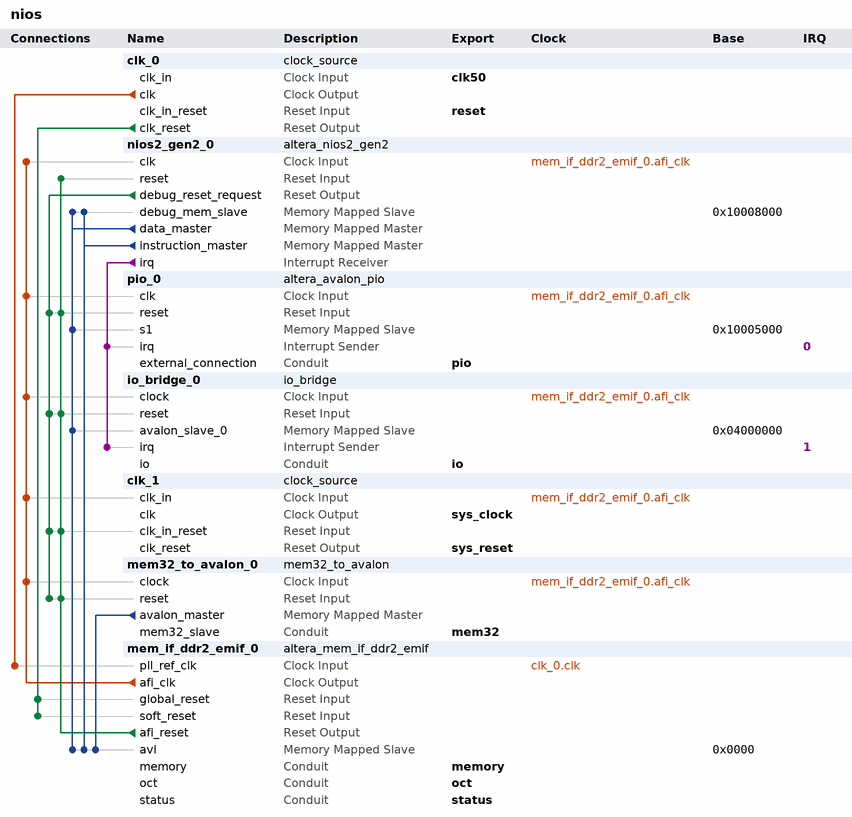
[diagram p0: system contents]
# Platform Designer (Qsys) system nios, Cyclone V 5CEBA2U15C8
# Parameters at their usual value, and those the tool derives, are not listed.
package require -exact qsys 15.1
create_system nios
set_project_property DEVICE_FAMILY {Cyclone V}
set_project_property DEVICE 5CEBA2U15C8

add_instance clk_0 clock_source 15.1
set_instance_parameter_value clk_0 clockFrequency 50000000
set_instance_parameter_value clk_0 resetSynchronousEdges DEASSERT

add_instance nios2_gen2_0 altera_nios2_gen2 15.1
set_instance_parameter_value nios2_gen2_0 dcache_bursts true
set_instance_parameter_value nios2_gen2_0 dcache_size 2048
set_instance_parameter_value nios2_gen2_0 exceptionSlave mem_if_ddr2_emif_0.avl
set_instance_parameter_value nios2_gen2_0 icache_burstType Sequential
set_instance_parameter_value nios2_gen2_0 icache_size 4096
set_instance_parameter_value nios2_gen2_0 impl Tiny
set_instance_parameter_value nios2_gen2_0 mul_32_impl 3
set_instance_parameter_value nios2_gen2_0 mul_shift_choice 1
set_instance_parameter_value nios2_gen2_0 resetSlave mem_if_ddr2_emif_0.avl

add_instance pio_0 altera_avalon_pio 15.1
set_instance_parameter_value pio_0 bitModifyingOutReg true
set_instance_parameter_value pio_0 direction InOut
set_instance_parameter_value pio_0 generateIRQ true
set_instance_parameter_value pio_0 width 32

add_instance io_bridge_0 io_bridge 1.0

add_instance clk_1 clock_source 15.1
set_instance_parameter_value clk_1 clockFrequency 50000000
set_instance_parameter_value clk_1 clockFrequencyKnown false
set_instance_parameter_value clk_1 resetSynchronousEdges DEASSERT

add_instance mem32_to_avalon_0 mem32_to_avalon 1.0

add_instance mem_if_ddr2_emif_0 altera_mem_if_ddr2_emif 15.1
set_instance_parameter_value mem_if_ddr2_emif_0 AVL_MAX_SIZE 4
set_instance_parameter_value mem_if_ddr2_emif_0 CALIBRATION_MODE Skip
set_instance_parameter_value mem_if_ddr2_emif_0 CFG_REORDER_DATA false
set_instance_parameter_value mem_if_ddr2_emif_0 CTL_LOOK_AHEAD_DEPTH 1
set_instance_parameter_value mem_if_ddr2_emif_0 DLL_SHARING_MODE None
set_instance_parameter_value mem_if_ddr2_emif_0 EXPORT_AFI_HALF_CLK false
set_instance_parameter_value mem_if_ddr2_emif_0 MEM_BANKADDR_WIDTH 2
set_instance_parameter_value mem_if_ddr2_emif_0 MEM_CK_WIDTH 1
set_instance_parameter_value mem_if_ddr2_emif_0 MEM_CLK_FREQ 200.0
set_instance_parameter_value mem_if_ddr2_emif_0 MEM_COL_ADDR_WIDTH 10
set_instance_parameter_value mem_if_ddr2_emif_0 MEM_DQ_WIDTH 8
set_instance_parameter_value mem_if_ddr2_emif_0 MEM_DRV_STR Reduced
set_instance_parameter_value mem_if_ddr2_emif_0 MEM_FORMAT DISCRETE
set_instance_parameter_value mem_if_ddr2_emif_0 MEM_NUMBER_OF_RANKS_PER_DIMM 1
set_instance_parameter_value mem_if_ddr2_emif_0 MEM_ROW_ADDR_WIDTH 14
set_instance_parameter_value mem_if_ddr2_emif_0 MEM_RTT_NOM 150
set_instance_parameter_value mem_if_ddr2_emif_0 MEM_TCL 3
set_instance_parameter_value mem_if_ddr2_emif_0 MEM_TMRD_CK 2
set_instance_parameter_value mem_if_ddr2_emif_0 MEM_TRAS_NS 45.0
set_instance_parameter_value mem_if_ddr2_emif_0 MEM_TRCD_NS 13.0
set_instance_parameter_value mem_if_ddr2_emif_0 MEM_TREFI_US 7.0
set_instance_parameter_value mem_if_ddr2_emif_0 MEM_TRFC_NS 75.0
set_instance_parameter_value mem_if_ddr2_emif_0 MEM_TRP_NS 13.0
set_instance_parameter_value mem_if_ddr2_emif_0 MEM_VENDOR JEDEC
set_instance_parameter_value mem_if_ddr2_emif_0 PLL_SHARING_MODE None
set_instance_parameter_value mem_if_ddr2_emif_0 POWER_OF_TWO_BUS false
set_instance_parameter_value mem_if_ddr2_emif_0 REF_CLK_FREQ 50.0
set_instance_parameter_value mem_if_ddr2_emif_0 SPEED_GRADE 8
set_instance_parameter_value mem_if_ddr2_emif_0 TIMING_BOARD_AC_TO_CK_SKEW 0.0
set_instance_parameter_value mem_if_ddr2_emif_0 TIMING_TDH 125
set_instance_parameter_value mem_if_ddr2_emif_0 TIMING_TDQSQ 200
set_instance_parameter_value mem_if_ddr2_emif_0 TIMING_TDS 50
set_instance_parameter_value mem_if_ddr2_emif_0 TIMING_TIH 250
set_instance_parameter_value mem_if_ddr2_emif_0 TIMING_TIS 175
set_instance_parameter_value mem_if_ddr2_emif_0 TIMING_TQHS 300
set_instance_parameter_value mem_if_ddr2_emif_0 USER_DEBUG_LEVEL 0

# connections
add_connection clk_0.clk mem_if_ddr2_emif_0.pll_ref_clk clock
add_connection mem_if_ddr2_emif_0.afi_clk clk_1.clk_in clock
add_connection mem_if_ddr2_emif_0.afi_clk io_bridge_0.clock clock
add_connection mem_if_ddr2_emif_0.afi_clk mem32_to_avalon_0.clock clock
add_connection mem_if_ddr2_emif_0.afi_clk nios2_gen2_0.clk clock
add_connection mem_if_ddr2_emif_0.afi_clk pio_0.clk clock
add_connection clk_0.clk_reset mem_if_ddr2_emif_0.global_reset reset
add_connection clk_0.clk_reset mem_if_ddr2_emif_0.soft_reset reset
add_connection mem_if_ddr2_emif_0.afi_reset clk_1.clk_in_reset reset
add_connection mem_if_ddr2_emif_0.afi_reset io_bridge_0.reset reset
add_connection mem_if_ddr2_emif_0.afi_reset mem32_to_avalon_0.reset reset
add_connection mem_if_ddr2_emif_0.afi_reset nios2_gen2_0.reset reset
add_connection mem_if_ddr2_emif_0.afi_reset pio_0.reset reset
add_connection nios2_gen2_0.debug_reset_request clk_1.clk_in_reset reset
add_connection nios2_gen2_0.debug_reset_request io_bridge_0.reset reset
add_connection nios2_gen2_0.debug_reset_request mem32_to_avalon_0.reset reset
add_connection nios2_gen2_0.debug_reset_request pio_0.reset reset
add_connection mem32_to_avalon_0.avalon_master mem_if_ddr2_emif_0.avl avalon
set_connection_parameter_value mem32_to_avalon_0.avalon_master/mem_if_ddr2_emif_0.avl baseAddress 0x0000
add_connection nios2_gen2_0.data_master io_bridge_0.avalon_slave_0 avalon
set_connection_parameter_value nios2_gen2_0.data_master/io_bridge_0.avalon_slave_0 baseAddress 0x04000000
add_connection nios2_gen2_0.data_master mem_if_ddr2_emif_0.avl avalon
set_connection_parameter_value nios2_gen2_0.data_master/mem_if_ddr2_emif_0.avl baseAddress 0x0000
add_connection nios2_gen2_0.data_master nios2_gen2_0.debug_mem_slave avalon
set_connection_parameter_value nios2_gen2_0.data_master/nios2_gen2_0.debug_mem_slave baseAddress 0x10008000
add_connection nios2_gen2_0.data_master pio_0.s1 avalon
set_connection_parameter_value nios2_gen2_0.data_master/pio_0.s1 baseAddress 0x10005000
add_connection nios2_gen2_0.instruction_master mem_if_ddr2_emif_0.avl avalon
set_connection_parameter_value nios2_gen2_0.instruction_master/mem_if_ddr2_emif_0.avl baseAddress 0x0000
add_connection nios2_gen2_0.instruction_master nios2_gen2_0.debug_mem_slave avalon
set_connection_parameter_value nios2_gen2_0.instruction_master/nios2_gen2_0.debug_mem_slave baseAddress 0x10008000
add_connection nios2_gen2_0.irq io_bridge_0.irq interrupt
set_connection_parameter_value nios2_gen2_0.irq/io_bridge_0.irq irqNumber 1
add_connection nios2_gen2_0.irq pio_0.irq interrupt
set_connection_parameter_value nios2_gen2_0.irq/pio_0.irq irqNumber 0

# exported interfaces
add_interface clk50 clock sink
set_interface_property clk50 EXPORT_OF clk_0.clk_in
add_interface io conduit end
set_interface_property io EXPORT_OF io_bridge_0.io
add_interface mem32 conduit end
set_interface_property mem32 EXPORT_OF mem32_to_avalon_0.mem32_slave
add_interface memory conduit end
set_interface_property memory EXPORT_OF mem_if_ddr2_emif_0.memory
add_interface oct conduit end
set_interface_property oct EXPORT_OF mem_if_ddr2_emif_0.oct
add_interface pio conduit end
set_interface_property pio EXPORT_OF pio_0.external_connection
add_interface reset reset sink
set_interface_property reset EXPORT_OF clk_0.clk_in_reset
add_interface status conduit end
set_interface_property status EXPORT_OF mem_if_ddr2_emif_0.status
add_interface sys_clock clock source
set_interface_property sys_clock EXPORT_OF clk_1.clk
add_interface sys_reset reset source
set_interface_property sys_reset EXPORT_OF clk_1.clk_reset

set_interconnect_requirement {$system} qsys_mm.clockCrossingAdapter HANDSHAKE
set_interconnect_requirement {$system} qsys_mm.enableEccProtection FALSE
set_interconnect_requirement {$system} qsys_mm.insertDefaultSlave FALSE
set_interconnect_requirement {$system} qsys_mm.maxAdditionalLatency 1

save_system nios.qsys
